# EAGLE design crawler2body (EAGLE 8.7.0)
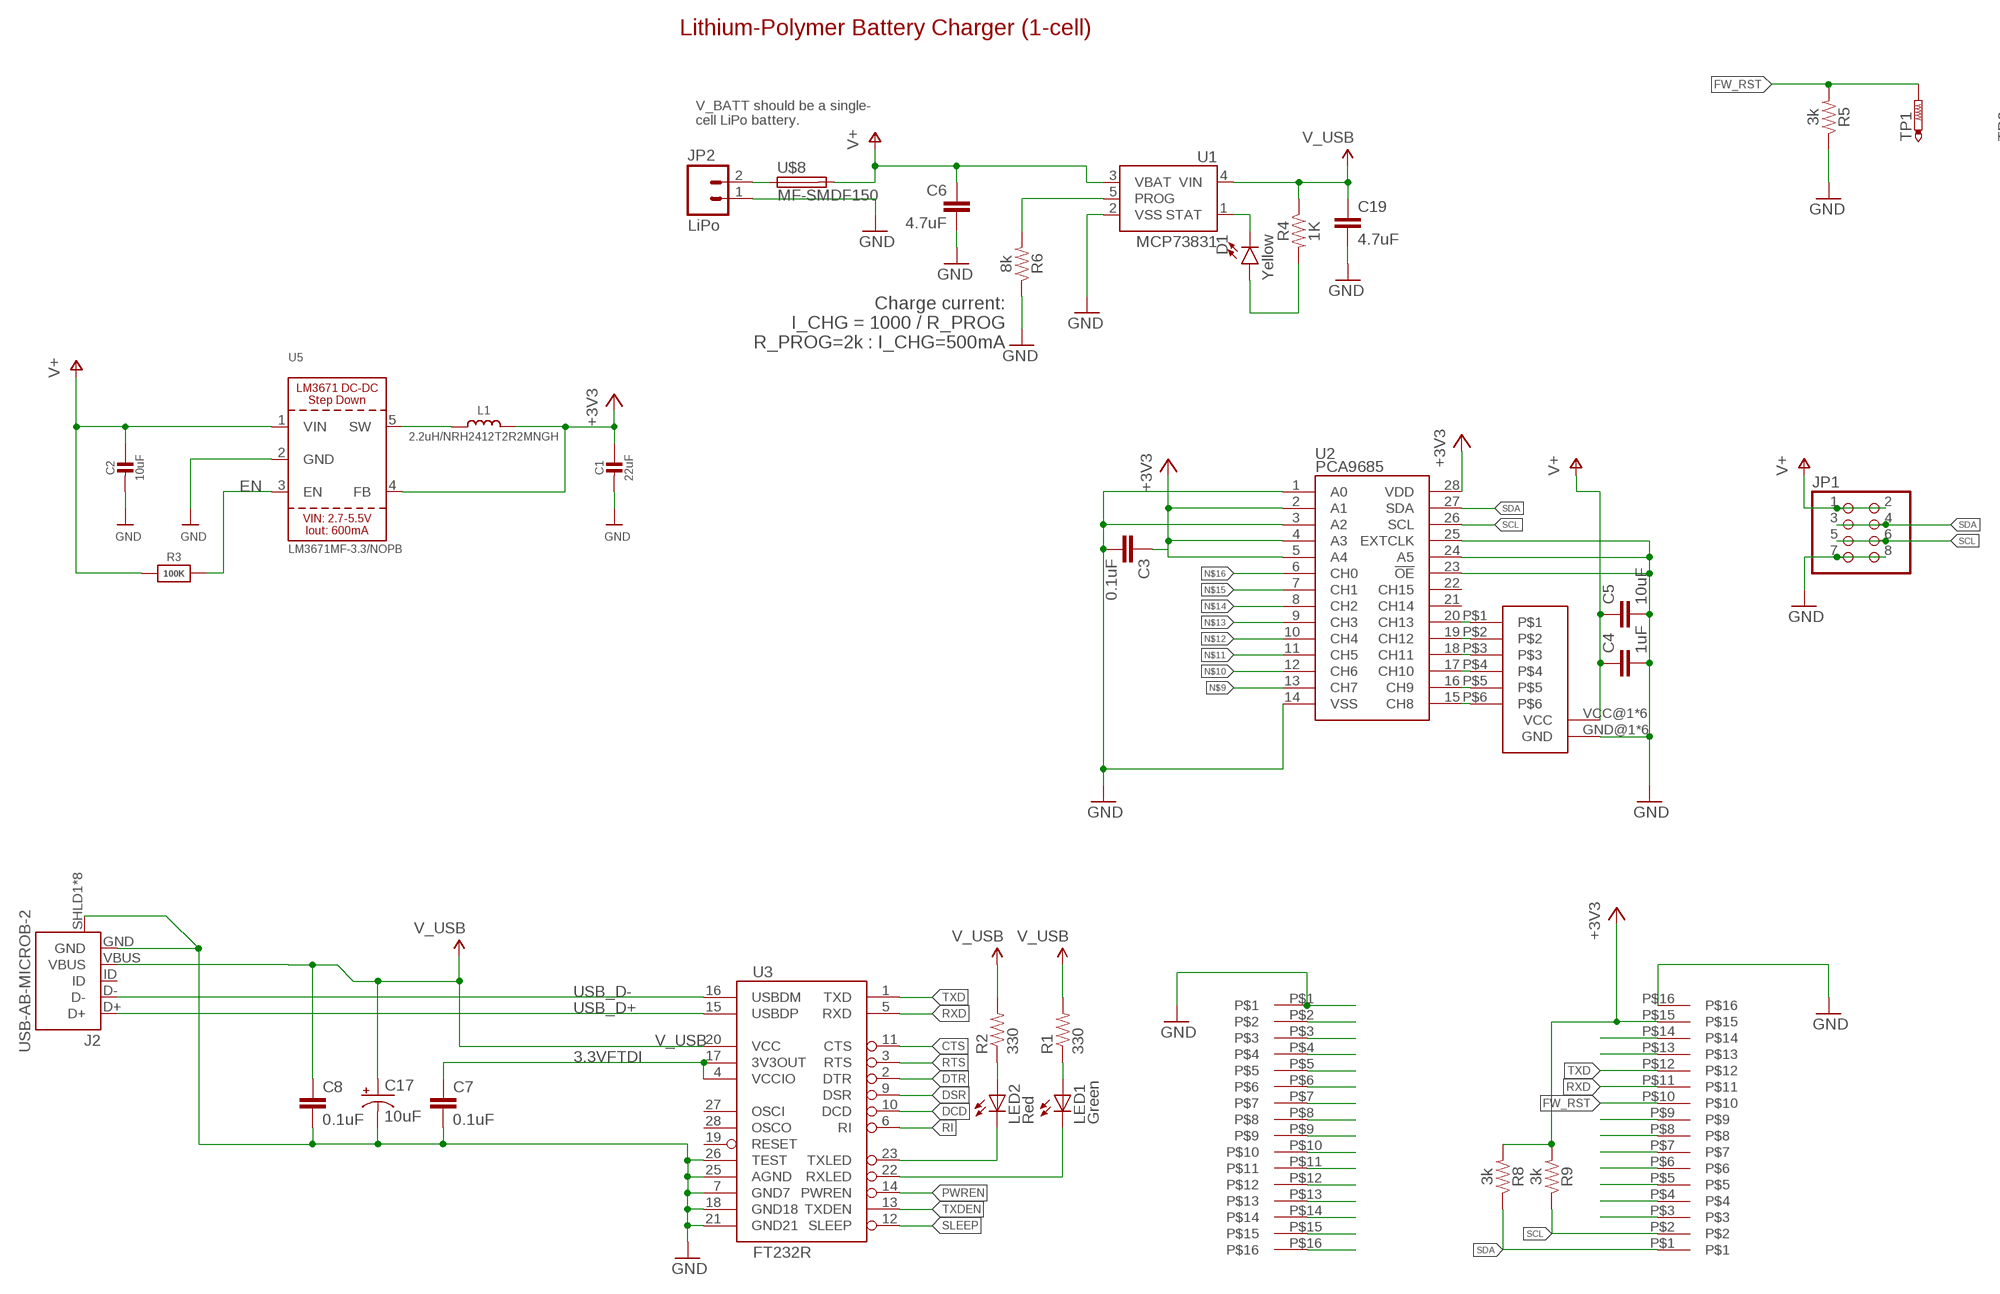
[diagram p0: schematic, sheet 1, part 1 of 2]
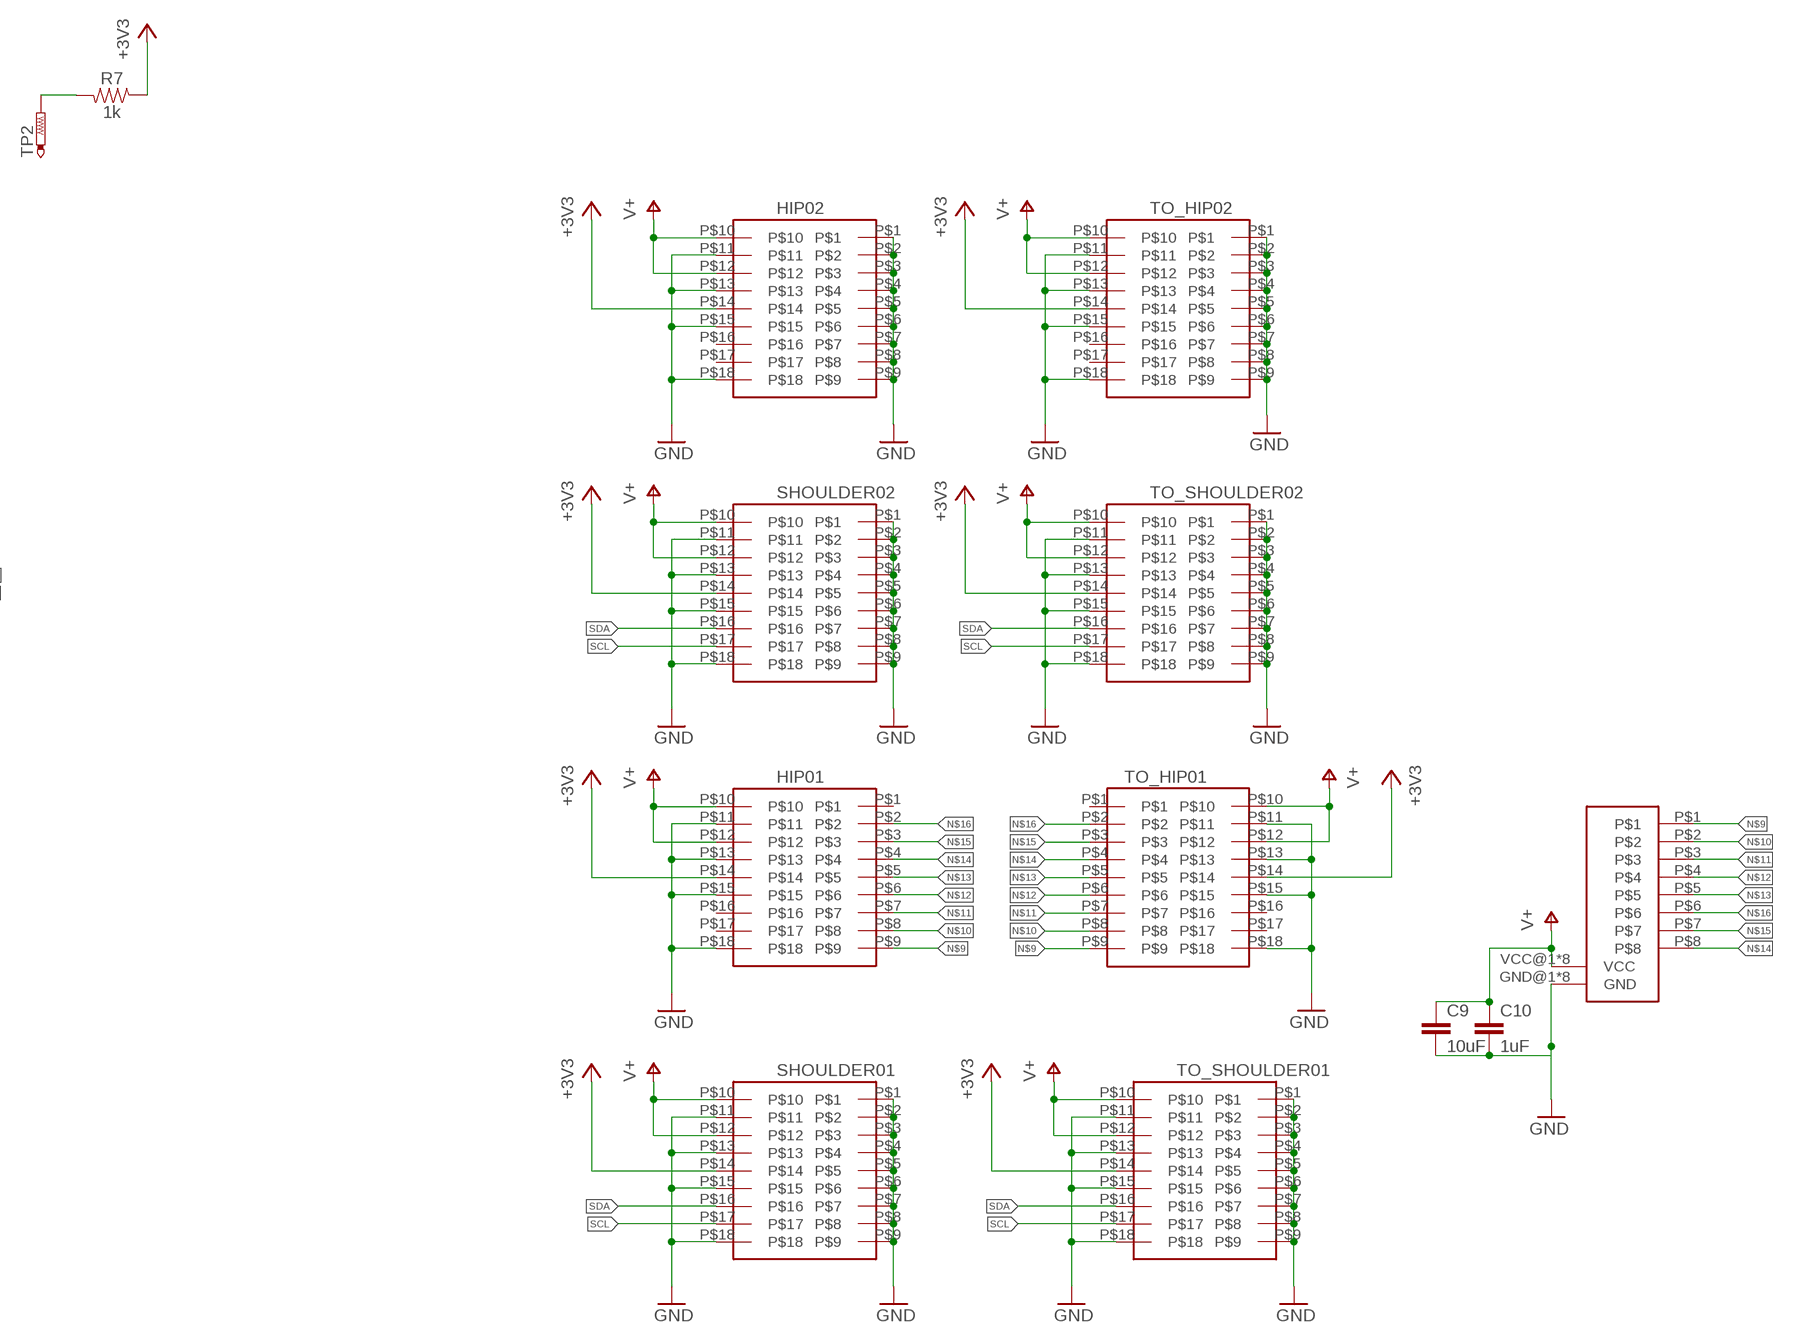
[diagram p1: schematic, sheet 1, part 2 of 2]

## Parts
C1  22uF  CAP_CERAMIC0805-NOOUTLINE  [0805-NO]
C2  10uF  CAP_CERAMIC0805-NOOUTLINE  [0805-NO]
C3  0.1uF  0.1UF-25V(+80/-20%)(0603)  [0603-CAP]
C4  1uF  C-EUC1210  [C1210]
C5  10uF  C-EUC1210  [C1210]
C6  4.7uF  4.7UF0603  [0603]
C7  0.1uF  0.1UF-25V(+80/-20%)(0603)  [0603-CAP]
C8  0.1uF  0.1UF-25V(+80/-20%)(0603)  [0603-CAP]
C9  10uF  C-EUC1210  [C1210]
C10  1uF  C-EUC1210  [C1210]
C17  10uF  10UF-16V-10%(TANT)  [EIA3216]
C19  4.7uF  4.7UF0603  [0603]
D1  Yellow  LED-YELLOW0603  [LED-0603]
HIP01  BOARD2BOARD_SLOT  [BOARD2BOARD_SLOT]
HIP02  BOARD2BOARD_SLOT  [BOARD2BOARD_SLOT]
J2  USB-AB-MICROB-2  [USB-MICROB-10118194]
JP1  PINHD-2X4  [2X04]
JP2  LiPo  M02-JST-2-PTH-NO_SILK  [JST-2-PTH-NS]
L1  2.2uH/NRH2412T2R2MNGH  INDUCTORNRH2412T  [INDUCTOR_TAIYOYUDEN_NRH2412T]
LED1  Green  LED-GREEN0603  [LED-0603@1]
LED2  Red  LED-RED0603  [LED-0603@1]
R1  330  330OHM1/10W1%(0603)  [0603-RES]
R2  330  330OHM1/10W1%(0603)  [0603-RES]
R3  100K  RESISTOR0805_NOOUTLINE  [0805-NO]
R4  1K  1KOHM-1/10W-1%(0603)  [0603]
R5  3k  2.0KOHM1/10W5%(0603)  [0603]
R6  8k  2.0KOHM1/10W5%(0603)  [0603]
R7  1k  2.0KOHM1/10W5%(0603)  [0603]
R8  3k  2.0KOHM1/10W5%(0603)  [0603]
R9  3k  2.0KOHM1/10W5%(0603)  [0603]
SHOULDER01  BOARD2BOARD_SLOT  [BOARD2BOARD_SLOT]
SHOULDER02  BOARD2BOARD_SLOT  [BOARD2BOARD_SLOT]
TO_HIP01  BOARD2BOARD  [BOARD2BOARD]
TO_HIP02  BOARD2BOARD  [BOARD2BOARD]
TO_SHOULDER01  BOARD2BOARD  [BOARD2BOARD]
TO_SHOULDER02  BOARD2BOARD  [BOARD2BOARD]
TP1  PTR1TP15SQ  [TP15SQ]
TP2  PTR1TP15SQ  [TP15SQ]
U1  MCP73831  [SOT23-5]
U2  PCA9685  [TSSOP-28_4MM]
U3  FT232R  FT232RLSSOP  [SSOP28DB]
U5  LM3671MF-3.3/NOPB  VREG_LM3671  [SOT23-5]
U$1  SPLITPAC_OMEGA2  [SPLITTED_OMEGA2]
U$2  SPLITPAC_OMEGA2  [SPLITTED_OMEGA2]
U$3  RC8CHAN  [RC8CHAN]
U$4  RC6CHAN  [RC6CHAN]
U$8  MF-SMDF150  [MF-SMDF050]

## Nets
3.3VFTDI [power]: C7.1 U3.4(VCCIO) U3.17(3V3OUT)
+3V3: C1.1 C3.1 HIP01.P$14 HIP02.P$14 L1.2 R7.1 R8.2 R9.2 SHOULDER01.P$14 SHOULDER02.P$14 TO_HIP01.P$14 TO_HIP02.P$14 TO_SHOULDER01.P$14 TO_SHOULDER02.P$14 U2.2(A1) U2.4(A3) U2.5(A4) U2.28(VDD) U5.4(FB) U$2.P$15
CTS: U3.11(CTS)
DCD: U3.10(DCD)
DSR: U3.9(DSR)
DTR: U3.2(DTR)
EN: R3.2 U5.3(EN)
FW_RST: R5.2 TP1.TP U$2.P$10
GND: C1.2 C2.2 C3.2 C4.2 C5.2 C6.2 C7.2 C8.2 C9.2 C10.2 C17.C(-) C19.2 HIP01.P$11 HIP01.P$13 HIP01.P$15 HIP01.P$18 HIP02.P$1 HIP02.P$2 HIP02.P$3 HIP02.P$4 HIP02.P$5 HIP02.P$6 HIP02.P$7 HIP02.P$8 HIP02.P$9 HIP02.P$11 HIP02.P$13 HIP02.P$15 HIP02.P$18 J2.GND J2.SHLD1(SHIELD) J2.SHLD2(SHIELD) J2.SHLD3(SHIELD) J2.SHLD4(SHIELD) J2.SHLD5(SHIELD) J2.SHLD6(SHIELD) J2.SHLD7(SHIELD) J2.SHLD8(SHIELD) JP1.7 JP1.8 JP2.1 R5.1 R6.1 SHOULDER01.P$1 SHOULDER01.P$2 SHOULDER01.P$3 SHOULDER01.P$4 SHOULDER01.P$5 SHOULDER01.P$6 SHOULDER01.P$7 SHOULDER01.P$8 SHOULDER01.P$9 SHOULDER01.P$11 SHOULDER01.P$13 SHOULDER01.P$15 SHOULDER01.P$18 SHOULDER02.P$1 SHOULDER02.P$2 SHOULDER02.P$3 SHOULDER02.P$4 SHOULDER02.P$5 SHOULDER02.P$6 SHOULDER02.P$7 SHOULDER02.P$8 SHOULDER02.P$9 SHOULDER02.P$11 SHOULDER02.P$13 SHOULDER02.P$15 SHOULDER02.P$18 TO_HIP01.P$11 TO_HIP01.P$13 TO_HIP01.P$15 TO_HIP01.P$18 TO_HIP02.P$1 TO_HIP02.P$2 TO_HIP02.P$3 TO_HIP02.P$4 TO_HIP02.P$5 TO_HIP02.P$6 TO_HIP02.P$7 TO_HIP02.P$8 TO_HIP02.P$9 TO_HIP02.P$11 TO_HIP02.P$13 TO_HIP02.P$15 TO_HIP02.P$18 TO_SHOULDER01.P$1 TO_SHOULDER01.P$2 TO_SHOULDER01.P$3 TO_SHOULDER01.P$4 TO_SHOULDER01.P$5 TO_SHOULDER01.P$6 TO_SHOULDER01.P$7 TO_SHOULDER01.P$8 TO_SHOULDER01.P$9 TO_SHOULDER01.P$11 TO_SHOULDER01.P$13 TO_SHOULDER01.P$15 TO_SHOULDER01.P$18 TO_SHOULDER02.P$1 TO_SHOULDER02.P$2 TO_SHOULDER02.P$3 TO_SHOULDER02.P$4 TO_SHOULDER02.P$5 TO_SHOULDER02.P$6 TO_SHOULDER02.P$7 TO_SHOULDER02.P$8 TO_SHOULDER02.P$9 TO_SHOULDER02.P$11 TO_SHOULDER02.P$13 TO_SHOULDER02.P$15 TO_SHOULDER02.P$18 U1.2(VSS) U2.1(A0) U2.3(A2) U2.14(VSS) U2.23(!OE) U2.24(A5) U2.25(EXTCLK) U3.7(GND7) U3.18(GND18) U3.21(GND21) U3.25(AGND) U3.26(TEST) U5.2(GND) U$1.P$1 U$2.P$16 U$3.GND@1(GND) U$3.GND@2(GND) U$3.GND@3(GND) U$3.GND@4(GND) U$3.GND@5(GND) U$3.GND@6(GND) U$3.GND@7(GND) U$3.GND@8(GND) U$4.GND@1(GND) U$4.GND@2(GND) U$4.GND@3(GND) U$4.GND@4(GND) U$4.GND@5(GND) U$4.GND@6(GND)
N$1: L1.1 U5.5(SW)
N$2: D1.A R4.2
N$3: U2.20(CH13) U$4.P$1
N$4: U2.19(CH12) U$4.P$2
N$5: U2.18(CH11) U$4.P$3
N$6: U2.17(CH10) U$4.P$4
N$7: U2.16(CH9) U$4.P$5
N$8: U2.15(CH8) U$4.P$6
N$9: HIP01.P$9 TO_HIP01.P$9 U2.13(CH7) U$3.P$1
N$10: HIP01.P$8 TO_HIP01.P$8 U2.12(CH6) U$3.P$2
N$11: HIP01.P$7 TO_HIP01.P$7 U2.11(CH5) U$3.P$3
N$12: HIP01.P$6 TO_HIP01.P$6 U2.10(CH4) U$3.P$4
N$13: HIP01.P$5 TO_HIP01.P$5 U2.9(CH3) U$3.P$5
N$14: HIP01.P$4 TO_HIP01.P$4 U2.8(CH2) U$3.P$8
N$15: HIP01.P$3 TO_HIP01.P$3 U2.7(CH1) U$3.P$7
N$16: HIP01.P$2 TO_HIP01.P$2 U2.6(CH0) U$3.P$6
N$17: LED2.A R2.1
N$18: LED1.A R1.1
N$19: D1.C U1.1(STAT)
N$20: U$1.P$2
N$21: U$1.P$3
N$22: U$1.P$4
N$23: U$1.P$5
N$24: U$1.P$6
N$25: U$1.P$7
N$26: U$1.P$8
N$27: U$1.P$9
N$28: U$1.P$10
N$29: U$1.P$11
N$30: U$1.P$12
N$31: U$1.P$13
N$32: U$1.P$14
N$33: U$1.P$15
N$34: U$1.P$16
N$35: U$2.P$3
N$36: U$2.P$4
N$37: U$2.P$5
N$38: U$2.P$6
N$39: U$2.P$7
N$40: U$2.P$8
N$41: U$2.P$9
N$42: R7.2 TP2.TP
N$43: U$2.P$13
N$44: U$2.P$14
N$45: R6.2 U1.5(PROG)
N$46: JP2.2 U$8.1
PWREN: U3.14(PWREN)
RI: U3.6(RI)
RTS: U3.3(RTS)
RXD: U3.5(RXD) U$2.P$11
RXLED: LED1.C U3.22(RXLED)
SCL: JP1.5 JP1.6 R9.1 SHOULDER01.P$17 SHOULDER02.P$17 TO_SHOULDER01.P$17 TO_SHOULDER02.P$17 U2.26(SCL) U$2.P$2
SDA: JP1.3 JP1.4 R8.1 SHOULDER01.P$16 SHOULDER02.P$16 TO_SHOULDER01.P$16 TO_SHOULDER02.P$16 U2.27(SDA) U$2.P$1
SLEEP: U3.12(SLEEP)
TXD: U3.1(TXD) U$2.P$12
TXDEN: U3.13(TXDEN)
TXLED: LED2.C U3.23(TXLED)
USB_D+: J2.D+ U3.15(USBDP)
USB_D-: J2.D- U3.16(USBDM)
V+: C2.1 C4.1 C5.1 C6.1 C9.1 C10.1 HIP01.P$10 HIP01.P$12 HIP02.P$10 HIP02.P$12 JP1.1 JP1.2 R3.1 SHOULDER01.P$10 SHOULDER01.P$12 SHOULDER02.P$10 SHOULDER02.P$12 TO_HIP01.P$10 TO_HIP01.P$12 TO_HIP02.P$10 TO_HIP02.P$12 TO_SHOULDER01.P$10 TO_SHOULDER01.P$12 TO_SHOULDER02.P$10 TO_SHOULDER02.P$12 U1.3(VBAT) U5.1(VIN) U$3.VCC@1(VCC) U$3.VCC@2(VCC) U$3.VCC@3(VCC) U$3.VCC@4(VCC) U$3.VCC@5(VCC) U$3.VCC@6(VCC) U$3.VCC@7(VCC) U$3.VCC@8(VCC) U$4.VCC@1(VCC) U$4.VCC@2(VCC) U$4.VCC@3(VCC) U$4.VCC@4(VCC) U$4.VCC@5(VCC) U$4.VCC@6(VCC) U$8.2
V_USB: C8.1 C17.A(+) C19.1 J2.VBUS R1.2 R2.2 R4.1 U1.4(VIN) U3.20(VCC)
Unconnected: HIP01.P$1 HIP01.P$16 HIP01.P$17 HIP02.P$16 HIP02.P$17 J2.ID TO_HIP01.P$1 TO_HIP01.P$16 TO_HIP01.P$17 TO_HIP02.P$16 TO_HIP02.P$17 U2.21(CH14) U2.22(CH15) U3.19(RESET) U3.27(OSCI) U3.28(OSCO)

## Notes on the sheet
- Lithium-Polymer Battery Charger (1-cell)
- V_BATT should be a single-
  cell LiPo battery.
- Charge current:
  I_CHG = 1000 / R_PROG
  R_PROG=2k : I_CHG=500mA

## Library data of the parts
C1 C2 = microbuilder:CAP_CERAMIC: Ceramic Capacitors For new designs, use the packages preceded by an '_' character since they are more reliable: The following footprints should be used on most boards: _0402 - Standard footprint for regular board layouts _0603 - Standard footprint for regular board layouts _0805 - Standard footprint for regular board layouts _1206 - Standard footprint for regular board layouts For extremely tight-pitch boards where space is at a premium, the following 'micro-pitch' footprints can be used (smaller pads, no silkscreen outline, etc.): _0402MP - Micro-pitch footprint for very dense/compact boards _0603MP - Micro-pitch footprint for very dense/compact boards _0805MP - Micro-pitch footprint for very dense/compact boards _1206MP - Micro-pitch footprint for very dense/compact boards
C3 C7 C8 = SparkFun-Capacitors:0.1UF-25V(+80/-20%)(0603): CAP-00810 Ceramic Standard decoupling cap; PROD_ID: CAP-00810
C4 C5 C9 C10 = rcl:C-EU: CAPACITOR, European symbol; SPICEPREFIX: C
C6 C19 = SparkFun-Capacitors:4.7UF: 4.7µF ceramic capacitors A capacitor is a passive two-terminal electrical component used to store electrical energy temporarily in an electric field.; PROD_ID: CAP-08280
C17 = SparkFun-Capacitors:10UF-16V-10%(TANT): CAP-00811 1206/EIA-3216 Tantalum capacitor; PROD_ID: CAP-00811
D1 = SparkFun-LED:LED-YELLOW: Yellow SMD LEDs LilyPad 1206- DIO-09909 0603- DIO-09003 "SMART" means more efficient and expensive; PROD_ID: DIO-09003
HIP01 HIP02 SHOULDER01 SHOULDER02 = crawler2:BOARD2BOARD_SLOT
J2 = mpp_bldc_ng_2:USB-AB: USB Connectors with ID-Pin (5 Pins); DIGIKEY: 609-4618-6-ND
JP1 = pinhead:PINHD-2X4: PIN HEADER
JP2 = SparkFun-Connectors:M02: Standard 2-pin 0.1" header. Use with - straight break away headers ( PRT-00116) - right angle break away headers (PRT-00553) - swiss pins (PRT-00743) - machine pins (PRT-00117) - female headers (PRT-00115) Molex polarized connector foot print use with: PRT-08233 with associated crimp pins and housings. 2.54_SCREWTERM for use with PRT-10571. 3.5mm Screw Terminal footprints for PRT-08084 5mm Screw Terminal footprints for use with PRT-08432
L1 = microbuilder:INDUCTOR: Inductors 0603: 10nH Ceramic Inductor - microwire antenna/RF (Digikey: 712-1434-2-ND) 0805: 560nH Ceramic Inductor - RF (Digikey: 553-1047-1-ND) 270nH Ceramic Inductor - Q = 40@250MHz, +-5%, 1 Ohm DC Resistance (Digikey: 535-10506-2-ND) 1007 (2518 Metric) SMT: 10µH 10% 250mOhm 820mA 1007 Inductor (Digikey: 587-2189-1-ND) 22µH 10% 500mOhm 580mA 1007 Inductor (Digikey: 587-2190-1-ND) 47µH 10% 950mOhm 420mA 1007 Inductor (Digikey: 587-2191-1-ND) 47µH 5% 100mOhm 1A 1008 Inductor (Digikey: 732-1816-1-ND) 5.0x5.0mm (Taiyo Yuden NR5040 Series) 6.8µH 20% 2.3A 64mOhm Inductor (Digikey: 587-2374-2-ND) 5.0x5.0mm (TDK VLC5045 Series) 4.7µH 20% 3.3A 34mOhm Inductor (Digikey: 445-6526-1-ND) 6.8µH 20% 2.7A 46mOhm Inductor (Digikey: 445-6527-1-ND) 6.0x6.0mm (TDK VLC6045 Series) 4.7µH 20% 3.8A 27mOhm Inductor (Digikey: 445-6538-2-ND) 6.8µH 20% 3A 41mOhm Inductor (Digikey: 445-6540-1-ND) 6.2µH 30% 2.2A 45mOhm Inductor (Digikey: SRR5028-6R2YCT-ND) - Not TDK VLC6045 but footprint should match 6.0x6.0mm (TDK SLF6045 Series) 6.8uH 30% 2A 33mOhm Inductor (Digikey: 445-4572-1-ND, Mouser: 810-SLF645T6R8N2R0PF) 6.0x6.0mm (Sumida CDRH5D28 Series) 6.2uH 30% 1.8A 45mOhm Inductor (Digikey: 308-1542-1-ND) Taiyo Yuden NR3015T2R2M - 2.2uH 20% 1.5A (Digikey: 587-1648-2-ND, Mouser: 963-NR3015T2R2M) - Used with TI TPS62172 CoilCraft RFID Transponder Coil - MA5532-AE (For use with AS3935 Lightning Sensor) Taiyo Yuden NRH2412T2R2MNGH - 2.2uH 20% 1AA (Digikey: 587-3443-1-ND) - Used with TI LM3671 Vishay IHLP 1.0uH Molded Inductor - 24mOhm DCR, 5A, +/-20%, -55°C-125°C (Digikey: 541-1319-1-ND)
LED1 = SparkFun-LED:LED-GREEN: Various green LEDs 0603- DIO-00821 LARGE- DIO-00862 LILYPAD- DIO-09910; PROD_ID: DIO-00821; VALUE: GREEN
LED2 = SparkFun-LED:LED-RED: Assorted Red LEDs LilyPad 1206- DIO-09912 1206- DIO-00809 0603- DIO-00819; PROD_ID: DIO-00819; VALUE: RED
R1 R2 = SparkFun-Resistors:330OHM1/10W1%(0603): RES-00818; PROD_ID: RES-00818
R3 = microbuilder:RESISTOR: Resistors For new designs, use the packages preceded by an '_' character since they are more reliable: The following footprints should be used on most boards: _0402 - Standard footprint for regular board layouts _0603 - Standard footprint for regular board layouts _0805 - Standard footprint for regular board layouts _1206 - Standard footprint for regular board layouts For extremely tight-pitch boards where space is at a premium, the following 'micro-pitch' footprints can be used (smaller pads, no silkscreen outline, etc.): _0402MP - Micro-pitch footprint for very dense/compact boards _0603MP - Micro-pitch footprint for very dense/compact boards _0805MP - Micro-pitch footprint for very dense/compact boards _1206MP - Micro-pitch footprint for very dense/compact boards
R4 = SparkFun-Resistors:1KOHM-1/10W-1%(0603): RES-07856; PROD_ID: RES-07856
R5-R9 = SparkFun-Resistors:2.0KOHM1/10W5%(0603): RES-08296; PROD_ID: RES-08296; VALUE: 2.0k
TO_HIP01 TO_HIP02 TO_SHOULDER01 TO_SHOULDER02 = crawler2:BOARD2BOARD
TP1 TP2 = testpad:PTR1: TEST PIN
U1 = SparkFun-PowerIC:MCP73831: Miniature single cell, fully integrated Li-Ion, Li-polymer charge management controller http://ww1.microchip.com/downloads/en/DeviceDoc/20001984g.pdf IC-09995; PROD_ID: IC-09995
U2 = SparkFun-IC-Special-Function:PCA9685: 16-channel 12-bit PWM I2C interface Internal Oscillator 40Hz to 1kHz Can be totem pole or open collector 2.3V to 5.5V SparkFun Products SparkFun Block for Intel® Edison - PWM <https://www.sparkfun.com/products/13042> (DEV-13042) PROTO: IC-12240 PROD_ID: IC-12271; PROD_ID: IC-12271
U3 = SparkFun:FT232RL: USB UART FT232RL 4th Generation USB UART (USB <-> Serial) Controller. Spark Fun Electronics SKU : COM-00650
U5 = microbuilder:VREG_LM3671: LM3671 - 600mA DC-DC Step-Down Converter VIN: 2.7-5.5V Load Current: 600mA Switching Frequency: 2MHz Iq: 16uA
U$1 U$2 = crawler2:SPLITPAC_OMEGA2
U$3 = crawler2:RC8CHAN
U$4 = crawler2:RC6CHAN
U$8 = fuse:MF-SMDF: MF-SMDF Series - PRC Resettable Fuses Source: http://www.farnell.com/datasheets/716597.pdf

## Net classes
1 power: width 0.152 mm

## Board
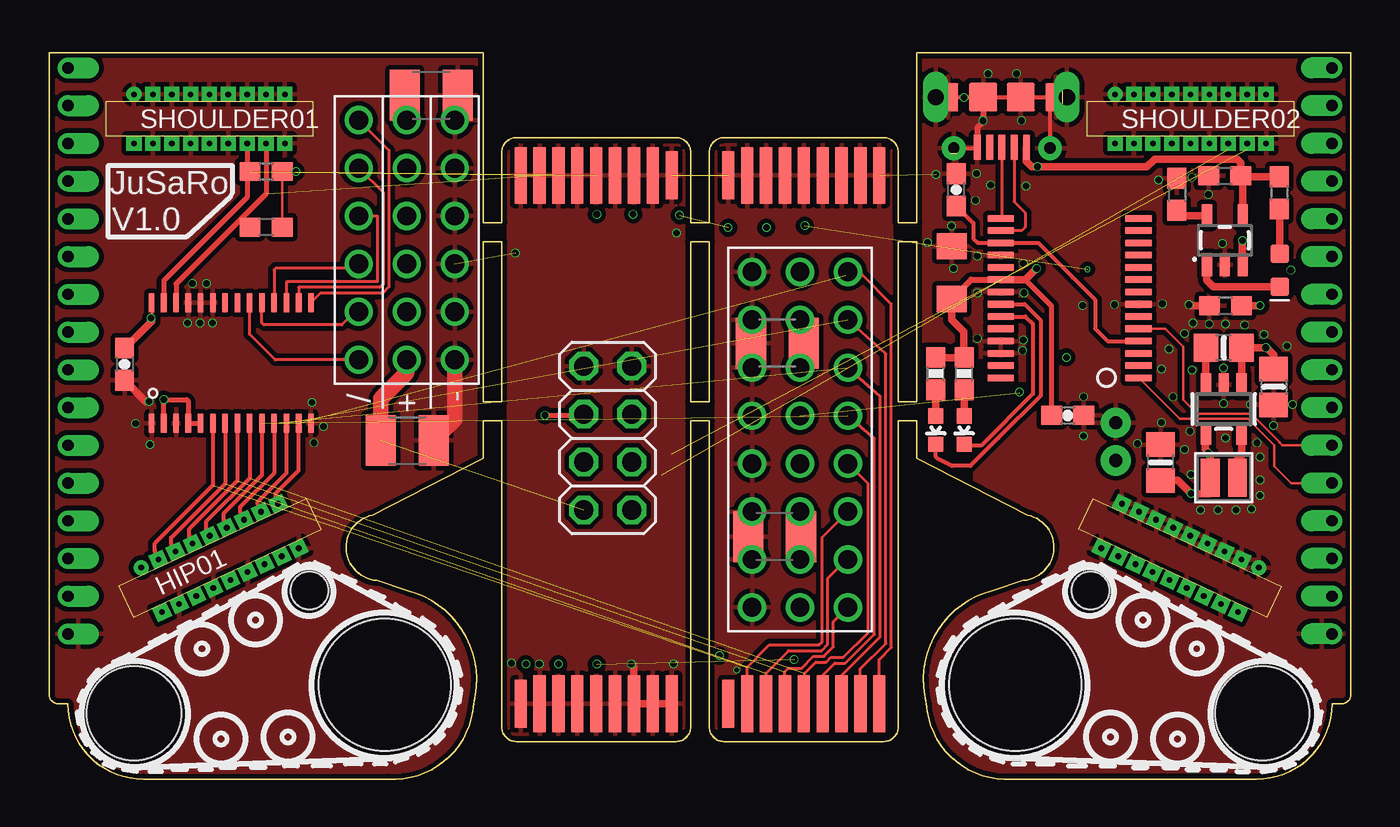
[diagram p2: board, top side]
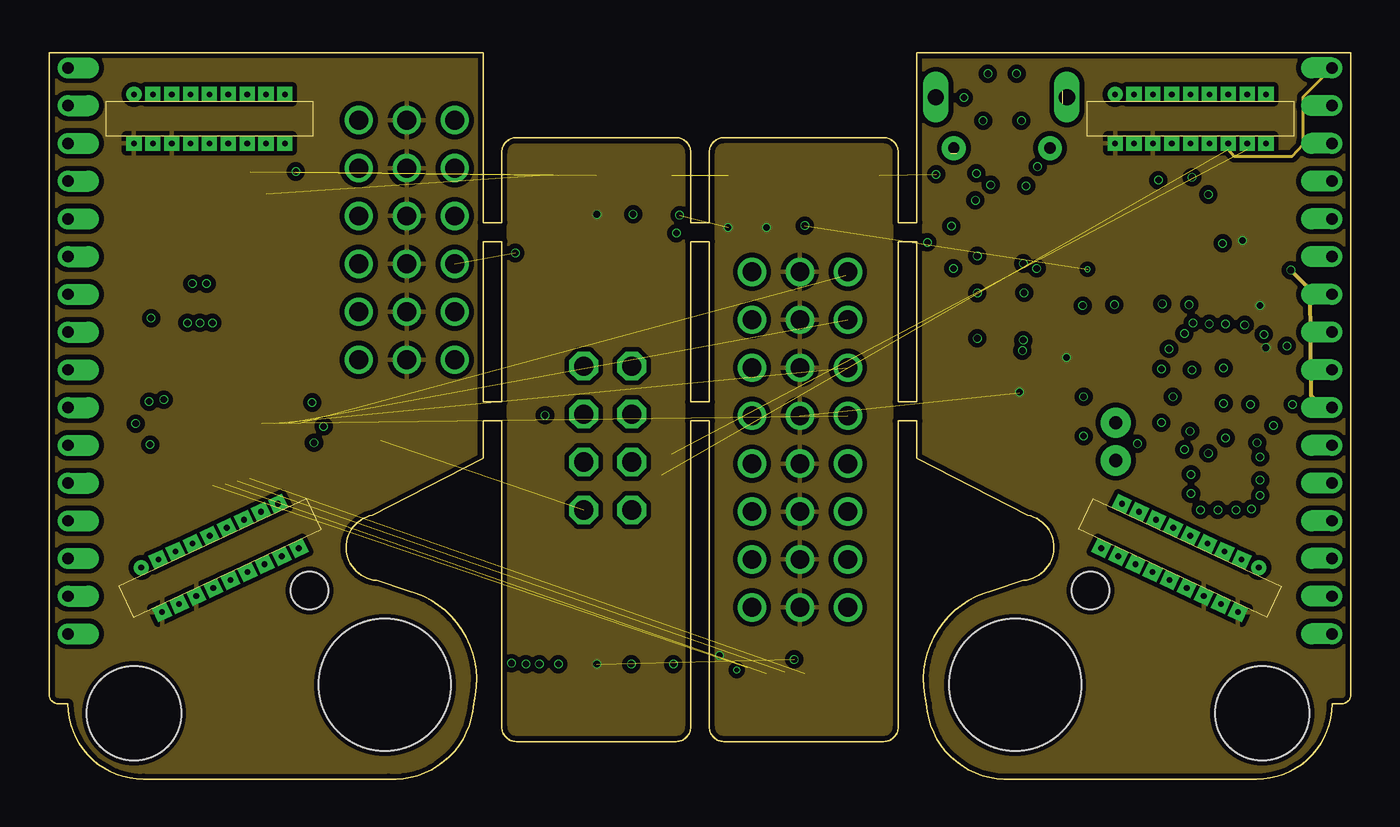
[diagram p3: board, inner layer Route2]
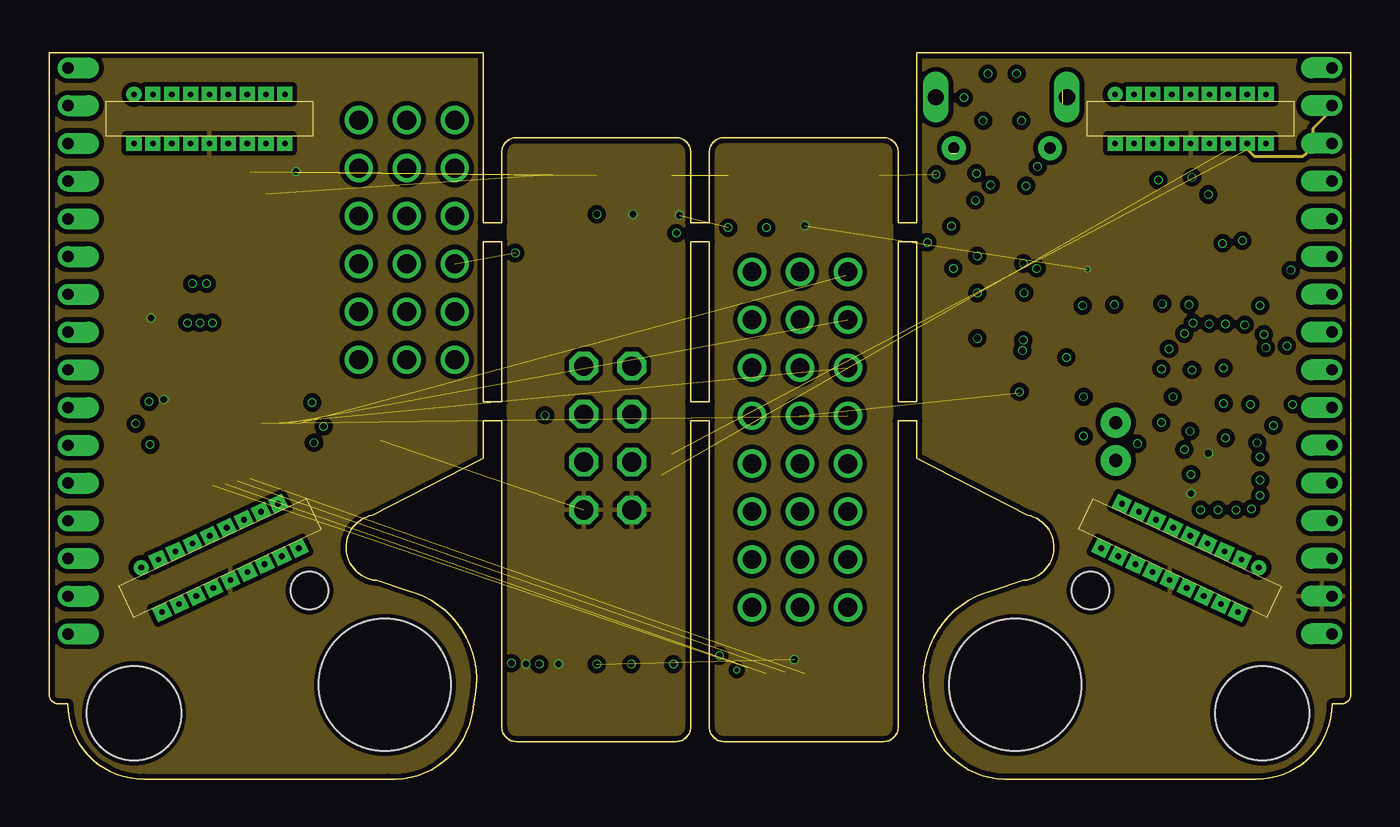
[diagram p4: board, inner layer Route15]
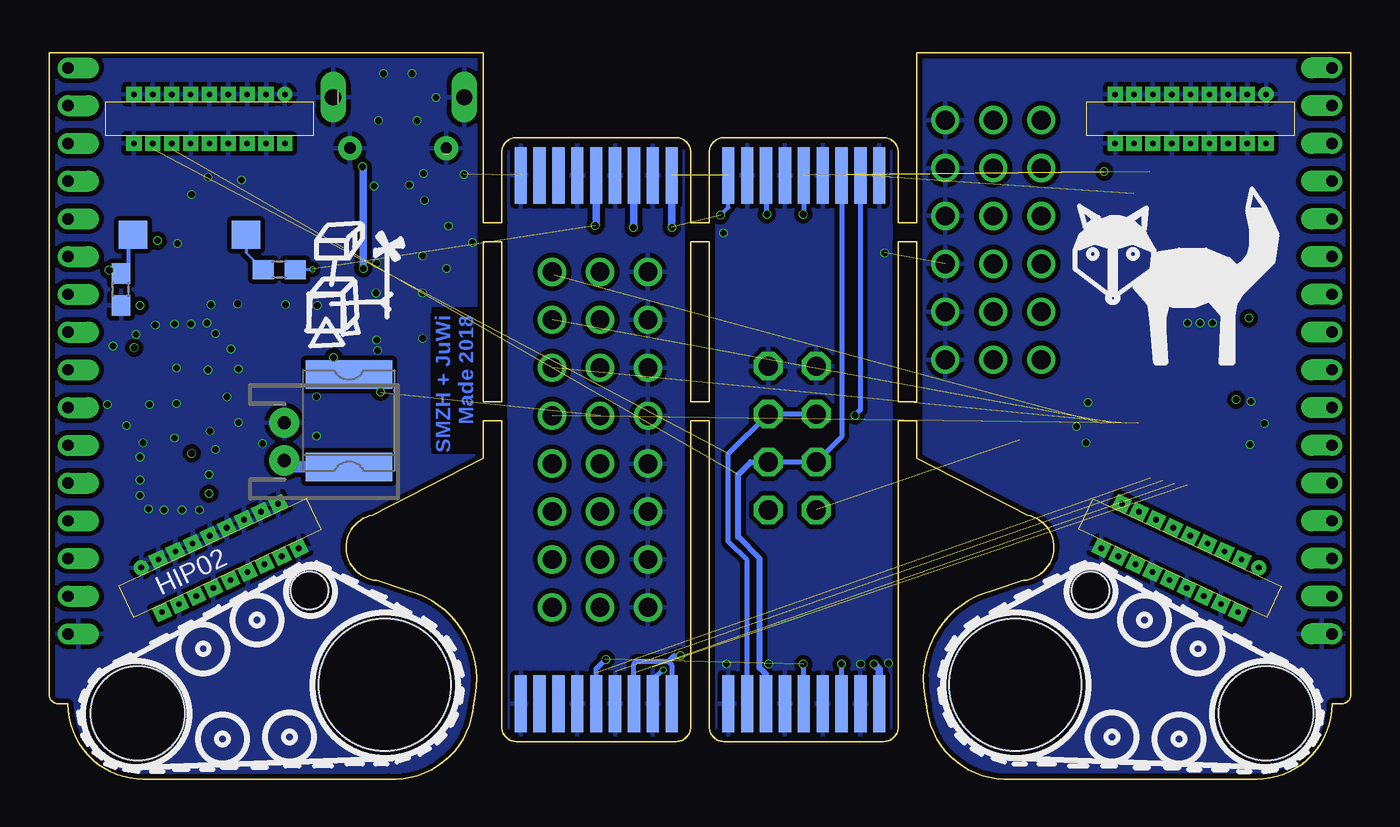
[diagram p5: board, bottom side, seen from below]

Size 69 x 38.5 mm. Coordinates in mm from the lower left corner, seen from the top.
Outline: 0,38.5 0,4.5 arc90 0.5,4 1,4 arc90 5,0 18,0 arc90 22.5,4 arc90 19,10 17.36,10.54 arc-164 17.14,14 23,17 23,19 24,19 24,2.75 arc90 24.75,2 33.25,2 arc90 34,2.75 34,19 35,19 35,2.75 arc90 35.75,2 44.25,2 arc90 45,2.75 45,19 46,19 46,17 51.86,14 arc-164 51.64,10.54 50,10 arc90 46.5,4 arc90 51,0 64,0 arc90 68,4 68.5,4 arc90 69,4.5 69,38.5 46,38.5 46,29.5 45,29.5 45,33.25 arc90 44.25,34 35.75,34 arc90 35,33.25 35,29.5 34,29.5 34,33.25 arc90 33.25,34 24.75,34 arc90 24,33.25 24,29.5 23,29.5 23,38.5 0,38.5
Outline: 24,20 24,28.5 23,28.5 23,20 24,20
Outline: 34,28.5 34,20 35,20 35,28.5 34,28.5
Outline: 45,28.5 45,20 46,20 46,28.5 45,28.5
Copper layers (1+2*15+16): Top 0.035mm / dielectric 1.5mm / Route2 0.035mm / dielectric 0.15mm / Route15 0.035mm / dielectric 0.2mm / Bottom 0.035mm
Design rules "aisler_go_2layer *": minimum track width 0.1mm, minimum drill 0.2mm, track to track 0.15mm, track to pad 0.1mm, pad to pad 0.1mm, via to via 0.1mm, smd to smd 0mil, copper to edge 0.2mm, drill to drill 0.21mm, minimum pad ring 0.25mm, minimum via ring 0.05mm, stop-mask expansion 0.01mm, vias tented up to drill 0mil, thermal gap 10mil
Holes 7 mm at 51.2,5 17.8,5
Holes 2 mm at 13.8,10 55.2,10
Holes 5 mm at 64.3,3.5 4.5,3.5

### Footprints (pad centres in the part's own frame; a part is rotated, then mirrored left to right if it is on the bottom)
0805-NO = smd 1.3 x 1.5: 1 -0.95,0; 2 0.95,0
0603-CAP = smd 1.1 x 1: 1 -0.85,0; 2 0.85,0
C1210 = smd 1.6 x 2.7: 1 -1.4,0; 2 1.4,0
0603 = smd 1.1 x 1: 1 -0.85,0; 2 0.85,0
EIA3216 = smd 1.4 x 1.6: A 1.4,0; C -1.4,0
LED-0603 = smd 1 x 1: A 0,-0.877; C 0,0.877
BOARD2BOARD_SLOT = drill 0.3 pad 0.711: P$1 1,2.3 | drill 0.3 pad 0.711 square: P$2 2,2.3; P$3 3,2.3; P$4 4,2.3; P$5 5,2.3; P$6 6,2.3; P$7 7,2.3; P$8 8,2.3; P$9 9,2.3; P$10 1,-0.3; P$11 2,-0.3; P$12 3,-0.3; P$13 4,-0.3; P$14 5,-0.3; P$15 6,-0.3; P$16 7,-0.3; P$17 8,-0.3; P$18 9,-0.3
USB-MICROB-10118194 = smd 1.3 x 0.4: D+ -2.5,0; D- -2.5,-0.65; GND -2.5,1.3; ID -2.5,0.65; VBUS -2.5,-1.3 | drill 0.6 pad 1.27: SHLD1 -2.55,2.55; SHLD2 -2.55,-2.55 | drill 0.85 pad 1.27 long: SHLD3 0.15,3.5; SHLD4 0.15,-3.45 | smd 1.5 x 1.1: SHLD5 0.15,2.85; SHLD6 0.15,-2.85 | smd 1.5 x 1.5: SHLD7 0.15,1; SHLD8 0.15,-1
2X04 = drill 1.016 octagon: 1 -3.81,-1.27; 2 -3.81,1.27; 3 -1.27,-1.27; 4 -1.27,1.27; 5 1.27,-1.27; 6 1.27,1.27; 7 3.81,-1.27; 8 3.81,1.27
JST-2-PTH-NS = drill 0.7 pad 1.6: 1 -1,0; 2 1,0
INDUCTOR_TAIYOYUDEN_NRH2412T = smd 1 x 2: 1 -0.725,0; 2 0.725,0
LED-0603@1 = smd 0.8 x 0.8: A 0,-0.75; C 0,0.75
0603-RES = smd 1.1 x 1: 1 -0.85,0; 2 0.85,0
BOARD2BOARD = smd 2.543 x 0.65: P$1 0,4 | smd 3 x 0.65: P$2 0,3; P$3 0,2; P$4 0,1; P$5 0,0; P$6 0,-1; P$7 0,-2; P$8 0,-3; P$9 0,-4 | smd 3 x 0.65 bottom: P$10 0,4; P$11 0,3; P$12 0,2; P$13 0,1; P$14 0,0; P$15 0,-1; P$16 0,-2; P$17 0,-3; P$18 0,-4
TP15SQ = smd 1.5 x 1.5: TP 0,0
SOT23-5 = smd 0.55 x 1.2: 1 -0.95,-1.3; 2 0,-1.3; 3 0.95,-1.3; 4 0.95,1.3; 5 -0.95,1.3
TSSOP-28_4MM = smd 1 x 0.3: 1 -3.2,4.225; 2 -3.2,3.575; 3 -3.2,2.925; 4 -3.2,2.275; 5 -3.2,1.625; 6 -3.2,0.975; 7 -3.2,0.325; 8 -3.2,-0.325; 9 -3.2,-0.975; 10 -3.2,-1.625; 11 -3.2,-2.275; 12 -3.2,-2.925; 13 -3.2,-3.575; 14 -3.2,-4.225; 15 3.2,-4.225; 16 3.2,-3.575; 17 3.2,-2.925; 18 3.2,-2.275; 19 3.2,-1.625; 20 3.2,-0.975; 21 3.2,-0.325; 22 3.2,0.325; 23 3.2,0.975; 24 3.2,1.625; 25 3.2,2.275; 26 3.2,2.925; 27 3.2,3.575; 28 3.2,4.225
SSOP28DB = smd 0.348 x 1.397: 1 -4.225,-3.656; 2 -3.575,-3.656; 3 -2.925,-3.656; 4 -2.275,-3.656; 5 -1.625,-3.656; 6 -0.975,-3.656; 7 -0.325,-3.656; 8 0.325,-3.656; 9 0.975,-3.656; 10 1.625,-3.656; 11 2.275,-3.656; 12 2.925,-3.656; 13 3.575,-3.656; 14 4.225,-3.656; 15 4.225,3.656; 16 3.575,3.656; 17 2.925,3.656; 18 2.275,3.656; 19 1.625,3.656; 20 0.975,3.656; 21 0.325,3.656; 22 -0.325,3.656; 23 -0.975,3.656; 24 -1.625,3.656; 25 -2.275,3.656; 26 -2.925,3.656; 27 -3.575,3.656; 28 -4.225,3.656
SPLITTED_OMEGA2 = drill 0.6 offset: P$1 2,16; P$2 2,14; P$3 2,12; P$4 2,10; P$5 2,8; P$6 2,6; P$7 2,4; P$8 2,2; P$9 2,0; P$10 2,-2; P$11 2,-4; P$12 2,-6; P$13 2,-8; P$14 2,-10; P$15 2,-12; P$16 2,-14
RC8CHAN = drill 1: GND@1 -2.54,8.89; GND@2 -2.54,6.35; GND@3 -2.54,3.81; GND@4 -2.54,1.27; GND@5 -2.54,-1.27; GND@6 -2.54,-3.81; GND@7 -2.54,-6.35; GND@8 -2.54,-8.89; P$1 2.54,8.89; P$2 2.54,6.35; P$3 2.54,3.81; P$4 2.54,1.27; P$5 2.54,-1.27; P$6 2.54,-3.81; P$7 2.54,-6.35; P$8 2.54,-8.89; VCC@1 0,8.89; VCC@2 0,6.35; VCC@3 0,3.81; VCC@4 0,1.27; VCC@5 0,-1.27; VCC@6 0,-3.81; VCC@7 0,-6.35; VCC@8 0,-8.89
RC6CHAN = drill 1: GND@1 -2.54,8.89; GND@2 -2.54,6.35; GND@3 -2.54,3.81; GND@4 -2.54,1.27; GND@5 -2.54,-1.27; GND@6 -2.54,-3.81; P$1 2.54,8.89; P$2 2.54,6.35; P$3 2.54,3.81; P$4 2.54,1.27; P$5 2.54,-1.27; P$6 2.54,-3.81; VCC@1 0,8.89; VCC@2 0,6.35; VCC@3 0,3.81; VCC@4 0,1.27; VCC@5 0,-1.27; VCC@6 0,-3.81
MF-SMDF050 = smd 1.5 x 4.6: 1 -2.45,0; 2 2.45,0

### Placement (x,y rotation side)
C1  58.91,16.8 90 top
C2  64.9,20.8 270 top
C3  4,22 270 top
C4  18.98,17.96 0 top
C5  20.25,36.26 0 top
C6  62.35,25.09 180 top
C7  48.09,31.24 90 top
C8  53.99,19.29 0 top
C9  38.6,23.12 180 top
C10  38.45,12.87 180 top
C17  47.85,26.85 270 top
C19  62.31,31.98 180 top
D1  65.23,26.98 180 top
HIP01  4.95,8.72 25 top
HIP02  64.05,8.72 25 bottom
J2  50.5,36 90 top
JP1  29.61,18.09 90 top
JP2  56.53,17.9 270 bottom
L1  62.26,15.98 180 top
LED1  47,18.5 180 top
LED2  48.5,18.5 180 top
R1  47,21.5 90 top
R2  48.5,21.5 90 top
R3  62.26,22.88 180 top
R4  65.2,31.08 270 top
R5  65.19,25.96 90 bottom
R6  59.77,31.01 270 top
R7  56.8,27 180 bottom
R8  11.5,32.22 0 top
R9  11.5,29.27 0 top
SHOULDER01  3.5,34 0 top
SHOULDER02  55.5,34 0 top
TO_HIP01  40,4 90 top
TO_HIP02  40,32 90 top
TO_SHOULDER01  29,4 90 top
TO_SHOULDER02  29,32 270 top
TP1  64.55,28.86 0 bottom
TP2  58.55,28.86 0 bottom
U1  62.31,28.57 0 top
U2  9.66,22.06 90 top
U3  54.09,25.5 90 top
U5  62.26,19.62 180 top
U$1  3,23.7 180 top
U$2  66,21.7 0 top
U$3  39.8,18 0 top
U$4  18.96,31.13 180 top
U$8  53.11,19.01 90 bottom

### Tracks (layer width: path | path; a pad name or v marks a point on that pad's centre or on a via)
3.3VFTDI
  Top 0.2: C7.1 48.99,29.48 48.99,28.66 49.22,28.43 U3.17
  Top 0.203: U3.17 52.42,28.43 54.25,26.6 55.44,25.41 55.44,23.88 56.1,23.23 U3.4
+3V3  (via drill 0.2, 0.35)  (3 unrouted)
  Top 0.127: R9.2 R8.2 v13.08,32.21
  Top 0.152: U2.28 5.43,24.47 v5.41,24.44
  Top 0.254: U2.2 v6.08,20.12 7.29,20.12 7.38,20.03 U2.4 U2.5
  Top 0.406: L1.2 61.53,15.2 | 61.53,15.2 61.53,17.24 61.29,17.48 61.29,18.3 U5.4 | C1.1 59.83,15.85 v60.53,15.15 61.48,15.15 61.53,15.2 | C3.1 5.43,24.28 5.43,24.47
  Bottom 0.152: R7.1 55.92,27.03 v55.04,27.03
  Bottom 0.254: TO_SHOULDER01.P$14 29,6.07 v29.03,6.1 | TO_SHOULDER02.P$14 29,29.98 v29.03,29.95 | TO_HIP01.P$14 40,5.85 v39.49,6.36
  Bottom 0.406: TO_HIP02.P$14 40,29.4 v40.05,29.35
  other vias: 61.44,17.28
  pour Route15 (isolate 0.254): 0,38.5 22.65,38.5 22.65,0 0,0
  pour Route2 (isolate 0.254): 24.35,34 33.65,34 33.65,2 24.35,2
  pour Route15 (isolate 0.254): 35.35,34 44.65,34 44.65,2 35.35,2
  pour Route15 (isolate 0.254): 46.35,38.5 69,38.5 69,0 46.35,0
EN
  Top 0.406: U5.3 R3.2
FW_RST  (via drill 0.35)
  Route2 0.203: v65.81,26.98 66.82,25.97 66.88,20.35 67.52,19.7 U$2.P$10
  Bottom 0.152: R5.2 65.23,26.81 65.4,26.98
  Bottom 0.2: TP1.TP 64.79,28.62 64.79,28
  Bottom 0.203: 64.79,28.17 64.79,28 64.79,27.19 65,26.98 65.4,26.98 v65.81,26.98
GND  (via drill 0.25, 0.35)  (3 unrouted)
  Top 0.152: C5.2 21.65,35.09 U$4.GND@6 | C10.2 37.1,11.81 U$3.GND@7
  Top 0.2: J2.SHLD3 J2.SHLD5 J2.SHLD7 J2.SHLD8 53.11,36.15 | 53.11,36.15 J2.SHLD6 J2.SHLD4 | J2.SHLD1 49.15,33.45 J2.GND | J2.SHLD2 53.05,36.1 53.11,36.15
  Top 0.305: J2.SHLD7 49.5,34.86 49.2,34.56 J2.GND
  Top 0.406: C6.2 60.48,25.09 v60.42,25.15 | TO_SHOULDER01.P$18 TO_SHOULDER01.P$7 31,5.96 v30.86,6.1 | C3.2 5.13,20.02 v5.3,20.02 | C9.2 37.2,21.87 U$3.GND@3
  Top 0.813: C4.2 21.5,19.07 U$4.GND@1
  Bottom 0.254: TO_HIP01.P$11 37,5.34 v36.45,5.8
  other vias: 61.49,24.14 62.25,21.8 62.25,19.92 64.89,18.75 63.67,19.87 57.68,17.79 58.95,18.91 60.17,17.48 62.2,28.41 60.58,31.91 58.8,31.76 61.44,31 46.55,28.46 47.93,27.08 49.2,27.74 51.63,27.34 51.63,23.27 49.2,23.38 51.58,22.72 59,25.2 56.46,25.15 48.49,36.13 49.5,34.91 51.53,34.91 51.28,37.4 49.76,37.4 4.59,18.85 5.36,17.74 7.59,26.27 8.35,26.27 7.34,24.19 8,24.19 8.66,24.19 13.94,19.97 14.55,18.7 14.04,17.84 24.71,27.9 33.25,28.95 24.51,6.15 25.98,6.1 33.09,6.1 65.91,19.87 64.18,17.08 62.35,18.09 64.39,23.58 65.6,22.97 62.35,24.14 63.37,24.09 60.47,18.45 60.52,16.16 61.03,14.28 61.95,14.28 62.91,14.28 63.73,14.33 64.18,15.04 64.18,15.86 64.03,17.84 60.58,21.7 59.36,22.82 58.95,21.75 59.56,20.28 60.63,24.19 60.17,23.63 54.84,18.19 54.84,20.28 47.82,29.32 47.01,32.06 49.15,32.11 49.09,30.69 49.91,31.5 51.79,31.45 54.78,25.1 49.2,25.77 51.68,25.79
  pour Top (isolate 0.254): 35.35,34 44.65,34 44.65,2 35.35,2
  pour Top (isolate 0.254): 46.35,38.5 69,38.5 69,0 46.35,0
  pour Bottom (isolate 0.254): 0,38.5 22.65,38.5 22.65,0 0,0
  pour Top (isolate 0.254): 24.35,34 33.65,34 33.65,2 24.35,2
  pour Top (isolate 0.254): 0,38.5 22.65,38.5 22.65,0 0,0
  pour Bottom (isolate 0.254): 24.35,34 33.65,34 33.65,2 24.35,2
  pour Bottom (isolate 0.254): 35.35,34 44.65,34 44.65,2 35.35,2
  pour Bottom (isolate 0.254): 46.35,38.5 69,38.5 69,0 46.35,0
  cutout Top: 46.4,22.97 48.99,22.97 48.99,22.21 49.6,22.21 49.6,20.99 52.14,20.99 52.14,20.02 48.89,16.77 48.89,15.04 46.4,15.04
GND1
  cutout Bottom: 48.65,24.98 46.32,24.98 46.32,17.31 48.65,17.31
N$1
  Top 0.406: L1.1 62.98,16.95 63.21,17.17 U5.5
N$2
  Top 0.406: R4.2 65.23,30.2 D1.A
N$3
  Top 0.152: U$4.P$1 11.98,22.24 10.63,23.59 U2.20
N$4
  Top 0.152: U$4.P$2 16.21,24.78 15.52,24.09 11.4,24.09 11.28,24.21 U2.19
N$5
  Top 0.152: U$4.P$3 16.19,27.08 12.01,27.08 11.93,27 U2.18
N$6
  Top 0.152: U$4.P$4 17.4,29.86 17.4,26.37 12.62,26.37 12.58,26.33 U2.17
N$7
  Top 0.152: U$4.P$5 17.7,31.11 17.7,26.22 17.67,26.22 17.52,26.07 13.23,26.07 U2.16
N$8
  Top 0.152: U$4.P$6 18,33.35 18,26.1 17.68,25.77 14.38,25.77 U2.15
N$9  (1 unrouted)
  Top 0.152: TO_HIP01.P$9 44,6.34 44.65,6.99 44.65,25.18 43.12,26.71 42.22,26.71 U$3.P$1
  Top 0.203: U2.13 13.23,16.37 12.01,15.15 12.01,14.94 HIP01.P$9
N$10  (1 unrouted)
  Top 0.152: TO_HIP01.P$8 43,5.85 44.34,7.2 44.34,22.55 U$3.P$2
  Top 0.203: U2.12 12.58,16.22 11.05,14.69 HIP01.P$8
N$11  (1 unrouted)
  Top 0.152: TO_HIP01.P$7 42,5.51 44.04,7.55 44.04,20.31 U$3.P$3
  Top 0.203: U2.11 11.93,16.23 10.13,14.43 10.13,14.18 HIP01.P$7
N$12  (1 unrouted)
  Top 0.152: U$3.P$4 43.74,18.07 43.74,7.69 42.21,6.16 41.65,6.16 41,5.51 TO_HIP01.P$6
  Top 0.203: U2.10 11.28,16.12 9.27,14.1 9.27,13.77 HIP01.P$6
N$13  (1 unrouted)
  Top 0.152: TO_HIP01.P$5 40.05,4.06 40.05,5.63 40.64,6.21 41.19,6.21 41.44,6.46 42.08,6.46 43.41,7.78 43.41,15.67 U$3.P$5
  Top 0.203: U2.9 10.63,15.97 8.34,13.68 8.34,13.29 HIP01.P$5
N$14  (1 unrouted)
  Top 0.152: TO_HIP01.P$4 39,5.71 39.19,5.9 39.9,5.9 40.51,6.51 41.06,6.51 41.57,7.02 41.57,7.75 41.57,7.76 41.57,8.35 U$3.P$8
  Top 0.203: U2.8 9.98,15.82 7.44,13.27 7.44,12.91 HIP01.P$4
N$15  (1 unrouted)
  Top 0.152: TO_HIP01.P$3 38,5.63 39.19,6.82 40.94,6.82 41.27,7.15 41.27,7.88 41.27,10.66 42.27,11.65 U$3.P$7
  Top 0.203: U2.7 9.33,15.67 6.47,12.81 6.47,12.5 HIP01.P$3
N$16  (1 unrouted)
  Top 0.152: TO_HIP01.P$2 37,5.95 38.17,7.12 40.81,7.12 40.97,7.27 40.97,12.82 U$3.P$6
  Top 0.203: U2.6 8.68,15.57 5.61,12.5 5.61,12.15 HIP01.P$2
N$17
  Top 0.406: R2.1 LED2.A
N$18
  Top 0.406: R1.1 LED1.A
N$19
  Top 0.406: U1.1 61.36,26.45 61.71,26.1 D1.C
N$42
  Bottom 0.152: TP2.TP 58.55,27.91 R7.2
N$45
  Top 0.406: R6.2 60.06,29.87 U1.5
N$46
  Bottom 0.61: U$8.1 56.19,16.56 JP2.2
RXD
  Top 0.127: U3.5 59.16,23.88 60.12,22.92 60.12,20.12 60.86,19.38 63.71,19.38 65.22,17.87 65.22,17.84 65.36,17.7 U$2.P$11
RXLED
  Top 0.203: U3.22 51.71,25.18 52.55,24.34 52.55,20.34 50.31,18.1 48.83,16.62 47.86,16.62 47.06,17.03 47,17.09 LED1.C
SCL  (via drill 0.35)  (2 unrouted)
  Top 0.127: R9.1 10.23,29.69 10.23,29.78
  Top 0.254: U2.26 6.73,26.27 10.23,29.78 11.5,31.04 SHOULDER01.P$17 | v26.29,19.3 28.28,19.3 JP1.6
  Route15 0.152: SHOULDER02.P$17 63.5,33.41 63.88,33.03 66.48,33.03 66.78,33.28 67,33.5 67,34.5 68,35.5 U$2.P$2
  Bottom 0.254: TO_SHOULDER01.P$17 32,11.6 32.99,12.59 32.99,17.25 JP1.5 JP1.6 | TO_SHOULDER02.P$17 26,19.58 v26.29,19.3
SDA  (2 unrouted)
  Top 0.127: R8.1 10.5,32.06 10.5,31.91
  Top 0.254: U2.27 6.08,26.44 10.5,30.86 10.5,31.91 SHOULDER01.P$16
  Route2 0.152: SHOULDER02.P$16 62.5,33.39 62.81,33.03 65.89,33.03 66.48,33.66 66.48,36.18 U$2.P$1
  Bottom 0.254: JP1.3 JP1.4 27,18.16 TO_SHOULDER02.P$16
  Bottom 0.305: TO_SHOULDER01.P$16 31,5.57 31.33,5.91 31.33,11.7 32.48,12.84 32.48,16.15 31.81,16.82 JP1.3
TXD
  Top 0.127: U3.1 59.93,19.1 63.54,19.1 64.94,17.7 64.94,16.59 65.83,15.7 U$2.P$12
TXLED
  Top 0.203: U3.23 51.75,24.53 52.14,24.14 52.14,20.43 49.4,17.69 48.57,17.69 arc-90 LED2.C
USB_D+
  Top 0.152: J2.D+ 50.5,29.79 U3.15
USB_D-
  Top 0.152: J2.D- 51.15,30.62 51.74,30.03 51.74,29.27 51.55,29.08 U3.16
V+  (via drill 0.35)  (3 unrouted)
  Top 0.152: C5.1 18.85,35.04 U$4.VCC@6 | v51.43,20.53 51.43,20.48
  Top 0.406: C2.1 64.9,22.5 64.53,22.88 v64.49,22.88 R3.1 U5.1 | C6.1 64.17,25.09 v64.18,25.1 | U1.3 63.25,27.29 v63.25,28.55 | C9.1 39.8,21.9 U$3.VCC@3 | C10.1 39.8,12.82 U$3.VCC@7
  Top 0.813: C4.1 17.59,19.59 17.59,20.16 18.97,21.55 U$4.VCC@1
  Bottom 0.152: v53.92,22.36 53.92,22.27 U$8.2 52.36,21.46 v51.43,20.53
  Bottom 0.203: v33.42,29.9 33,30.31 TO_SHOULDER02.P$10
  Bottom 0.254: TO_SHOULDER01.P$12 v27,6.1 | TO_SHOULDER02.P$12 31,29.99 v30.96,29.95 | TO_HIP01.P$12 38,6.12 37.87,6.26 36.19,6.26 | TO_HIP01.P$10 36,6.06 36.19,6.26 | 36.19,6.26 35.89,6.56 v35.53,6.56
  Bottom 0.406: TO_HIP02.P$12 38,29.26 v38.02,29.24 | TO_HIP02.P$10 36,29.26 v35.99,29.24 | TO_SHOULDER01.P$10 25,5.83 v25.27,6.1
  pour Route2 (isolate 0.254): 0,38.5 22.65,38.5 22.65,0 0,0
  pour Route15 (isolate 0.254): 24.35,34 33.65,34 33.65,2 24.35,2
  pour Route2 (isolate 0.254): 35.35,34 44.65,34 44.65,2 35.35,2
  pour Route2 (isolate 0.254): 46.35,38.5 69,38.5 69,0 46.35,0
V_USB  (via drill 0.35)
  Top 0.254: C8.1 53.14,25.08 51.74,26.48
  Top 0.305: C17.A 48.88,26.48 U3.20
  Top 0.406: C19.1 63.16,32.68 62.96,32.88 58.59,32.88 58.19,32.47 v52.4,32.47 52.09,32.47 51.8,32.76 J2.VBUS | R4.1 63.21,31.93 C19.1 | C19.1 63.26,31.88 U1.4 | C17.A 47.85,24.37 48.48,23.73 48.48,22.37 R2.2 R1.2 | U3.20 51.74,26.48 v52.35,27.08
  Bottom 0.406: v52.35,27.08 52.35,32.42 v52.4,32.47

### Text on the board
Bottom: SMZH + JuWi / Made 2018
tPlace: JuSaRo | V1.0